# Altium project Modulo Banco MK1.PrjPcb (part 2 of 2)

## Sheet ADCs.SchDoc
size A4; SheetNumber: 5; SheetTotal: 6; SPICEModelCacheMZQGRJLK: <root> / <DocumentId>MZQGRJLK</DocumentId> / <CacheFrame Number="0"> / <Model Name="0603_885012206052_1uf" Kind="CKT"> / <Text>******* / .subckt 0603_885012206052_1uF 1 2 / Rser 1 3 0.00742821402486 / Lser 2 4 2.51142993E-10 / C1 3 4 0.000001 / Rpar 3 4 100000000 / .ends 0603_885012206052_1uF</Text> / </Model> / <Model Name="0603_885012206071_100nf" Kind="CKT"> / <Text>******* / .subckt 0603_885012206071_100nF 1 2 / Rser 1 3 0.025 / Lser 2 4 0.0000000008 / C1 3 4 0.0000001 / Rpar 3 4 5000000000 / .ends 0603_885012206071_100nF</Text> / </Model> / </CacheFrame> / </root>
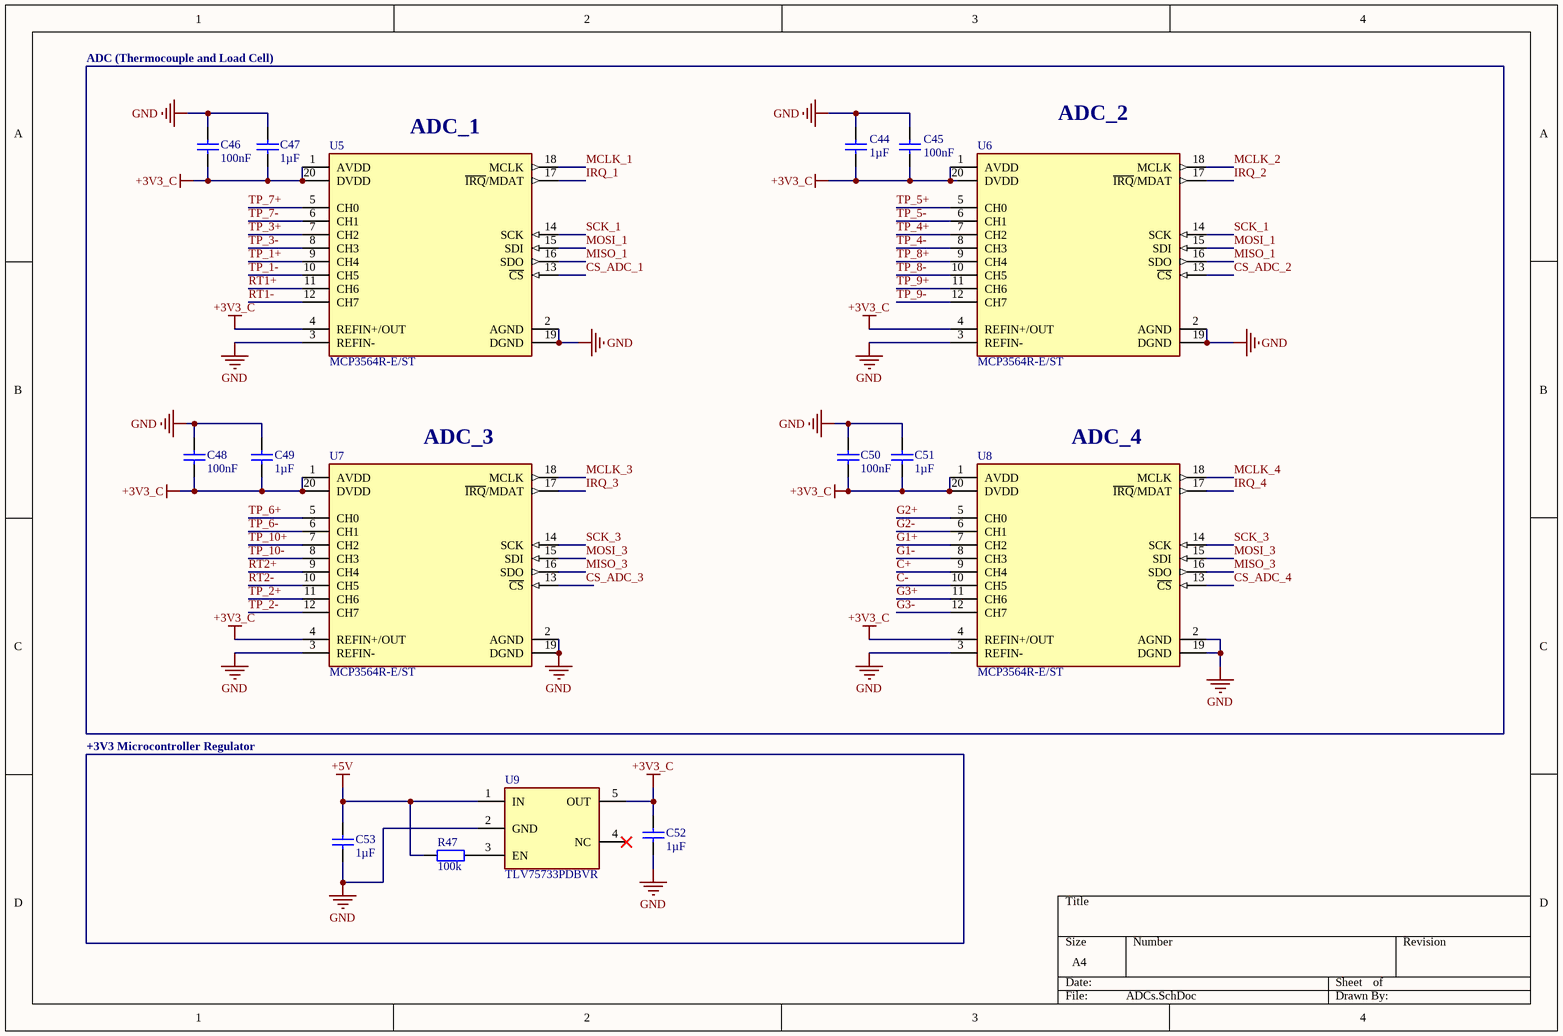
[diagram p4: ADCs.SchDoc]

### Parts
C44  value 1µF  [WCAP-CSGP_0603_L1.6W0.8H0.8_Reflow]  (hidden comment: 885012206052)
C45  value 100nF  [WCAP-CSGP_0603_L1.6W0.8H0.8_Reflow]  (hidden comment: 885012206071)
C46  value 100nF  [WCAP-CSGP_0603_L1.6W0.8H0.8_Reflow]  (hidden comment: 885012206071)
C47  value 1µF  [WCAP-CSGP_0603_L1.6W0.8H0.8_Reflow]  (hidden comment: 885012206052)
C48  value 100nF  [WCAP-CSGP_0603_L1.6W0.8H0.8_Reflow]  (hidden comment: 885012206071)
C49  value 1µF  [WCAP-CSGP_0603_L1.6W0.8H0.8_Reflow]  (hidden comment: 885012206052)
C50  value 100nF  [WCAP-CSGP_0603_L1.6W0.8H0.8_Reflow]  (hidden comment: 885012206071)
C51  value 1µF  [WCAP-CSGP_0603_L1.6W0.8H0.8_Reflow]  (hidden comment: 885012206052)
C52  value 1µF  [WCAP-CSGP_0603_L1.6W0.8H0.8_Reflow]  (hidden comment: 885012206052)
C53  value 1µF  [WCAP-CSGP_0603_L1.6W0.8H0.8_Reflow]  (hidden comment: 885012206052)
R47  value 100k  [WRIS-RSKS_0603_Reflow]  (hidden comment: 560112116004)
U5  MCP3564R-E/ST  [FP-C04-088-MFG]
U6  MCP3564R-E/ST  [FP-C04-088-MFG]
U7  MCP3564R-E/ST  [FP-C04-088-MFG]
U8  MCP3564R-E/ST  [FP-C04-088-MFG]
U9  TLV75733PDBVR  [SOT95P280X145-5N]

### Blocks framed on the sheet
+3V3 Microcontroller Regulator: C52 C53 R47 U9

### Nets
+3V3_C: C44.2 C45.1 C46.2 C47.1 C48.2 C49.1 C50.2 C51.1 C52.2 U5.1(AVDD) U5.4(REFIN+/OUT) U5.20(DVDD) U6.1(AVDD) U6.4(REFIN+/OUT) U6.20(DVDD) U7.1(AVDD) U7.4(REFIN+/OUT) U7.20(DVDD) U8.1(AVDD) U8.4(REFIN+/OUT) U8.20(DVDD) U9.5(OUT)
+5V: C53.2 R47.1 U9.1(IN)  [project net 5V_Current-]
GND: C44.1 C45.2 C46.1 C47.2 C48.1 C49.2 C50.1 C51.2 C52.1 C53.1 U5.2(AGND) U5.3(REFIN-) U5.19(DGND) U6.2(AGND) U6.3(REFIN-) U6.19(DGND) U7.2(AGND) U7.3(REFIN-) U7.19(DGND) U8.2(AGND) U8.3(REFIN-) U8.19(DGND) U9.2(GND)
C+: U8.9(CH4)
C-: U8.10(CH5)
CS_ADC_1: U5.13(~{CS})
CS_ADC_2: U6.13(~{CS})
CS_ADC_3: U7.13(~{CS})
CS_ADC_4: U8.13(~{CS})
G1+: U8.7(CH2)
G1-: U8.8(CH3)
G2+: U8.5(CH0)
G2-: U8.6(CH1)
G3+: U8.11(CH6)
G3-: U8.12(CH7)
IRQ_1: U5.17(~{IRQ}/MDAT)
IRQ_2: U6.17(~{IRQ}/MDAT)
IRQ_3: U7.17(~{IRQ}/MDAT)
IRQ_4: U8.17(~{IRQ}/MDAT)
MCLK_1: U5.18(MCLK)
MCLK_2: U6.18(MCLK)
MCLK_3: U7.18(MCLK)
MCLK_4: U8.18(MCLK)
MISO_1: U5.16(SDO) U6.16(SDO)
MISO_3: U7.16(SDO) U8.16(SDO)
MOSI_1: U5.15(SDI) U6.15(SDI)
MOSI_3: U7.15(SDI) U8.15(SDI)
RT1+: U5.11(CH6)
RT1-: U5.12(CH7)
RT2+: U7.9(CH4)
RT2-: U7.10(CH5)
SCK_1: U5.14(SCK) U6.14(SCK)
SCK_3: U7.14(SCK) U8.14(SCK)
TP_1+: U5.9(CH4)
TP_1-: U5.10(CH5)
TP_2+: U7.11(CH6)
TP_2-: U7.12(CH7)
TP_3+: U5.7(CH2)
TP_3-: U5.8(CH3)
TP_4+: U6.7(CH2)
TP_4-: U6.8(CH3)
TP_5+: U6.5(CH0)
TP_5-: U6.6(CH1)
TP_6+: U7.5(CH0)
TP_6-: U7.6(CH1)
TP_7+: U5.5(CH0)
TP_7-: U5.6(CH1)
TP_8+: U6.9(CH4)
TP_8-: U6.10(CH5)
TP_9+: U6.11(CH6)
TP_9-: U6.12(CH7)
TP_10+: U7.7(CH2)
TP_10-: U7.8(CH3)
NetR47_2: R47.2 U9.3(EN)

Not connected (* = marked no-connect by the designer): U9 4(NC)*

### Notes on the sheet
- ADC (Thermocouple and Load Cell)
- (near U5) ADC_1
- (near U6) ADC_2
- (near U7) ADC_3
- (near U8) ADC_4

### Library data of the parts
C44 C47 C49 C51-C53 = CMP-001-00642-1: WCAP-CSGP Multilayer Ceramic Chip Capacitor, General Purpose, size 0603, X7R, 1uF, 16VDC; Manufacturer: Wurth Elektronik; Capacitance Tolerance: +/-10%; Insulation Resistance: 0.1GOhm; Rated Voltage (DC): 16V; Dissipation Factor: 10%; Technical Reference: X7R0603105K016DFCT10000; Component Type: Standard; Width: 0.8mm; Ceramic Type: X7R; ComponentLink1Description: Website Link; ComponentLink1URL: https://www.we-online.com/redexpert/article/885012206052?ad; Height: 0.8mm; Manufacturer Part Number: 885012206052; Match Code: WCAP-CSGP; Source: WCAP-CSGP.SchLib; Case/Package: 0603; Operating Temperature Min: -55°C; ComponentLink2Description: Datasheet Link; Design Item ID: 885012206052; ComponentLink2URL: https://www.we-online.com/redexpert/spec/885012206052?ad; Category: Multilayer Ceramic Chip Capacitors; Packaging: Tape and Reel; Pins: 2; Length: 1.6mm; Operating Temperature Max: 125°C; Mount: Surface Mount
C45 C46 C48 C50 = CMP-001-00661-1: WCAP-CSGP Multilayer Ceramic Chip Capacitor, General Purpose, size 0603, X7R, 100nF, 25VDC; Manufacturer: Wurth Elektronik; Dissipation Factor: 3.5%; Capacitance Tolerance: +/-10%; Insulation Resistance: 5GOhm; Technical Reference: X7R0603104K025DFCT10000; Rated Voltage (DC): 25V; Packaging: Tape and Reel; Height: 0.8mm; Mount: Surface Mount; Source: WCAP-CSGP.SchLib; Component Type: Standard; Category: Multilayer Ceramic Chip Capacitors; Operating Temperature Min: -55°C; Case/Package: 0603; ComponentLink2Description: Datasheet Link; Width: 0.8mm; ComponentLink1URL: https://www.we-online.com/redexpert/article/885012206071?ad; Length: 1.6mm; Operating Temperature Max: 125°C; Match Code: WCAP-CSGP; ComponentLink2URL: https://www.we-online.com/redexpert/spec/885012206071?ad; Design Item ID: 885012206071; ComponentLink1Description: Website Link; Manufacturer Part Number: 885012206071; Pins: 2; Ceramic Type: X7R
R47 = CMP-009-00327-1: WRIS-RSKS Thick Film Resistor, size 0603, 100000Ohm, 100mW; Manufacturer: Wurth Elektronik; Temperature Coefficient of Resistance Min: -100ppm/°C; Resistance Tolerance: +/-1%; Limiting Element Voltage: 75V; Temperature Coefficient of Resistance Max: 100ppm/°C; Height: 0.45mm; ComponentLink1URL: https://www.we-online.com/redexpert/article/560112116004?ad; Packaging: Tape and Reel; Match Code: WRIS-RSKS; Operating Temperature Max: 155°C; ComponentLink2Description: Datasheet Link; ComponentLink1Description: Website Link; Category: Thick Film Resistors; Operating Temperature Min: -55°C; Length: 1.6mm; Source: WRIS-RSKS.SchLib; Rated Power: 100mW; Mount: Surface Mount; Manufacturer Part Number: 560112116004; ComponentLink2URL: https://www.we-online.com/redexpert/spec/560112116004?ad; Component Type: Standard; Width: 0.8mm; Case/Package: 0603; Pins: 2; Design Item ID: 560112116004
U5-U8 = CMP-015-00000-1: ADC, Delta-Sigma, 24-Bit, 1 Func, 8 Channel, Serial Access, PDSO20; RoHS Compliant: Yes
U9 = CMP-087-000000-3: LDO Voltage Regulators 1A Low-IQ Small-Size Low-Dropout (LDO) Regulator 5-SOT-23 -40 to 125; Manufacturer: Texas Instruments; Manufacturer Part Number: TLV75733PDBVR

## Sheet Sensing current.SchDoc
size A4; SheetNumber: 6; SheetTotal: 6; SPICEModelCacheWDWOYDAG: <root> / <DocumentId>WDWOYDAG</DocumentId> / <CacheFrame Number="0"> / <Model Name="0603_885012206062_3.3nf" Kind="CKT"> / <Text>******* / .subckt 0603_885012206062_3.3nF 1 2 / Rser 1 3 0.09865 / Lser 2 4 0.0000000003316 / C1 3 4 0.0000000033 / Rpar 3 4 10000000000 / .ends 0603_885012206062_3.3nF</Text> / </Model> / </CacheFrame> / </root>
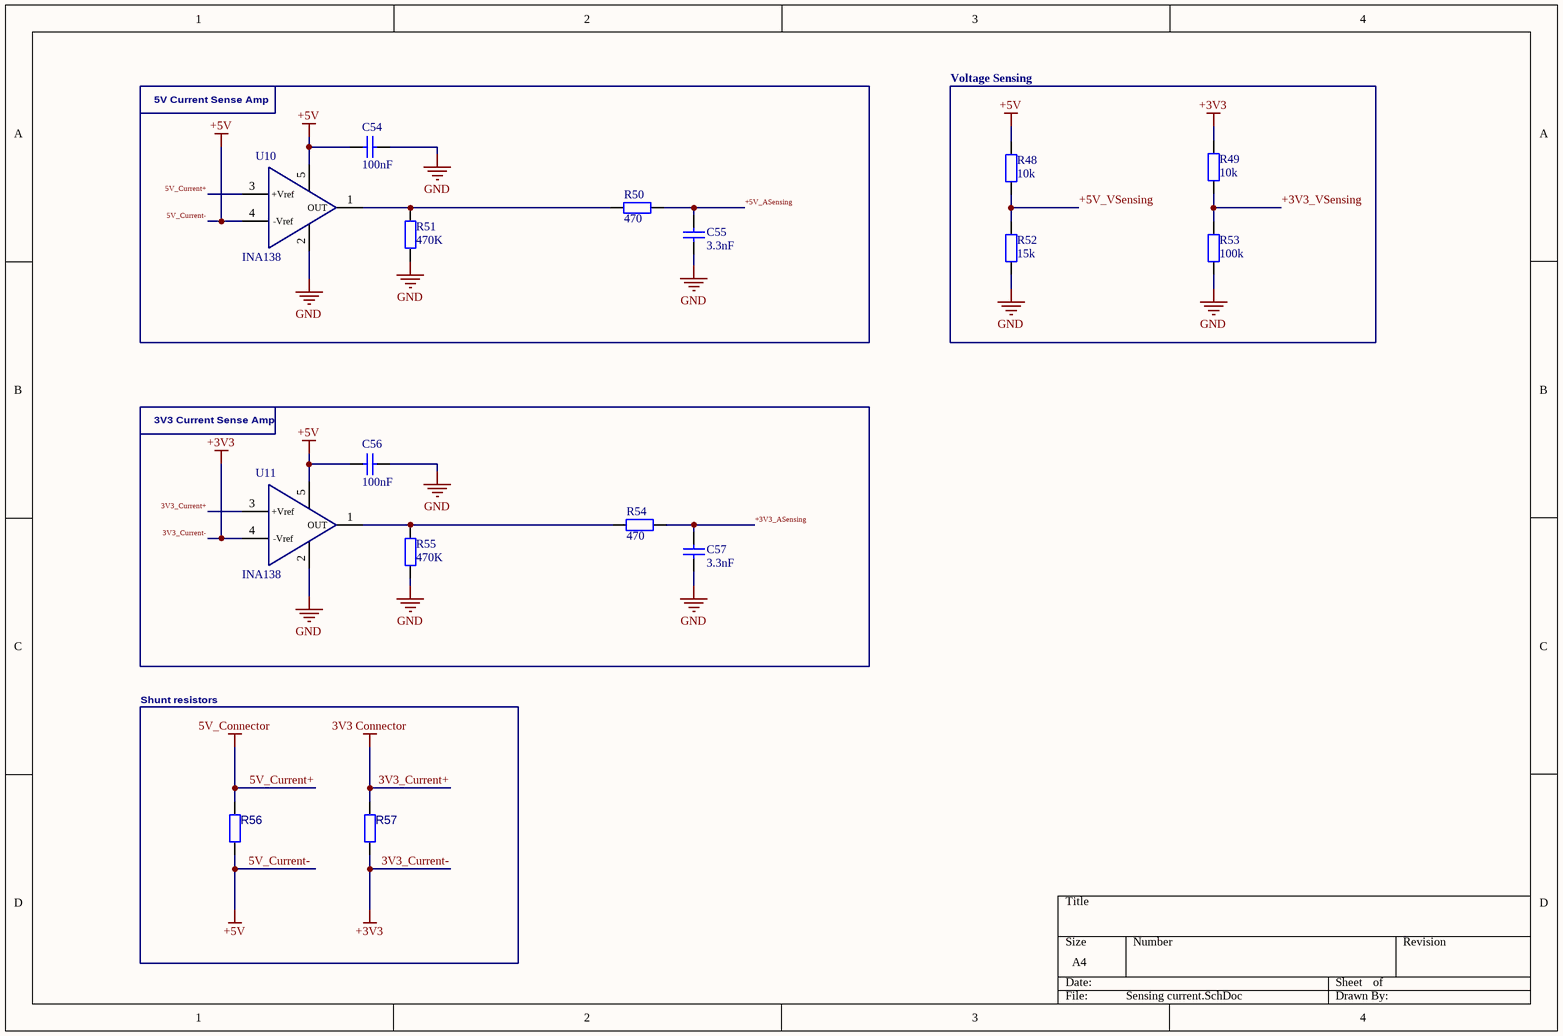
[diagram p5: Sensing current.SchDoc]

### Parts
C54  value 100nF  [WCAP-CSGP_0603_L1.6W0.8H0.8_Reflow]  (hidden comment: 885012206071)
C55  value 3.3nF  [WCAP-CSGP_0603_L1.6W0.8H0.8_Reflow]  (hidden comment: 885012206062)
C56  value 100nF  [WCAP-CSGP_0603_L1.6W0.8H0.8_Reflow]  (hidden comment: 885012206071)
C57  value 3.3nF  [WCAP-CSGP_0603_L1.6W0.8H0.8_Reflow]  (hidden comment: 885012206062)
R48  value 10k  [WRIS-RSKS_0603_Reflow]  (hidden comment: 560112116005)
R49  value 10k  [WRIS-RSKS_0603_Reflow]  (hidden comment: 560112116005)
R50  value 470  [WRIS-RSKS_0603_Reflow]  (hidden comment: 560112116067)
R51  value 470K  [WRIS-RSKS_0603_Reflow]  (hidden comment: 560112116019)
R52  value 15k  [WRIS-RSKS_0603_Reflow]  (hidden comment: 560112116035)
R53  value 100k  [WRIS-RSKS_0603_Reflow]  (hidden comment: 560112116004)
R54  value 470  [WRIS-RSKS_0603_Reflow]  (hidden comment: 560112116067)
R55  value 470K  [WRIS-RSKS_0603_Reflow]  (hidden comment: 560112116019)
R56  580070763010  [580070763010-Footprint-1]  (value not drawn)
R57  580070763010  [580070763010-Footprint-1]  (value not drawn)
U10  INA138  [INA138-Footprint-1]
U11  INA138  [INA138-Footprint-1]

### Blocks framed on the sheet
5V Current Sense Amp: C54 C55 R50 R51 U10
Voltage Sensing: R48 R49 R52 R53
3V3 Current Sense Amp: C56 C57 R54 R55 U11
Shunt resistors: R56 R57

### Nets
3V3_Current+: R57.2 U11.3(+Vref)  [also labelled 3V3 Connector]
3V3_Current-: R49.2 R57.1 U11.4(-Vref)  [also labelled +3V3]
5V_Current+: R56.2 U10.3(+Vref)  [also labelled 5V_Connector]
5V_Current-: C54.2 C56.2 R48.2 R56.1 U10.4(-Vref) U10.5(V+) U11.5(V+)  [also labelled +5V]
GND: C54.1 C55.1 C56.1 C57.1 R51.1 R52.1 R53.1 R55.1 U10.2(GND) U11.2(GND)
+3V3_ASensing: C57.2 R54.1
+3V3_VSensing: R49.1 R53.2
+5V_ASensing: C55.2 R50.1
+5V_VSensing: R48.1 R52.2
NetR50_2: R50.2 R51.2 U10.1(OUT)
NetR54_2: R54.2 R55.2 U11.1(OUT)

### Library data of the parts
C54 C56 = CMP-001-00661-1: as C45 on sheet ADCs; Packaging: Tape and Reel; Height: 0.8mm; Mount: Surface Mount; Source: WCAP-CSGP.SchLib; Component Type: Standard; Category: Multilayer Ceramic Chip Capacitors; Operating Temperature Min: -55°C; Case/Package: 0603; ComponentLink2Description: Datasheet Link; Width: 0.8mm; ComponentLink1URL: https://www.we-online.com/redexpert/article/885012206071?ad; Length: 1.6mm; Operating Temperature Max: 125°C; Match Code: WCAP-CSGP; ComponentLink2URL: https://www.we-online.com/redexpert/spec/885012206071?ad; Design Item ID: 885012206071; ComponentLink1Description: Website Link; Manufacturer Part Number: 885012206071; Pins: 2; Ceramic Type: X7R
C55 C57 = CMP-001-00652-1: WCAP-CSGP Multilayer Ceramic Chip Capacitor, General Purpose, size 0603, X7R, 3.3nF, 25VDC; Manufacturer: Wurth Elektronik; Capacitance Tolerance: +/-10%; Technical Reference: X7R0603332K025DFCT10000; Dissipation Factor: 3.5%; Rated Voltage (DC): 25V; Insulation Resistance: 10GOhm; ComponentLink2Description: Datasheet Link; Source: WCAP-CSGP.SchLib; Pins: 2; Operating Temperature Min: -55°C; Length: 1.6mm; ComponentLink2URL: https://www.we-online.com/redexpert/spec/885012206062?ad; Ceramic Type: X7R; Manufacturer Part Number: 885012206062; ComponentLink1URL: https://www.we-online.com/redexpert/article/885012206062?ad; ComponentLink1Description: Website Link; Mount: Surface Mount; Case/Package: 0603; Packaging: Tape and Reel; Component Type: Standard; Height: 0.8mm; Operating Temperature Max: 125°C; Width: 0.8mm; Match Code: WCAP-CSGP; Category: Multilayer Ceramic Chip Capacitors; Design Item ID: 885012206062
R48 R49 = CMP-009-00328-1: WRIS-RSKS Thick Film Resistor, size 0603, 10000Ohm, 100mW; Manufacturer: Wurth Elektronik; Limiting Element Voltage: 75V; Temperature Coefficient of Resistance Max: 100ppm/°C; Resistance Tolerance: +/-1%; Temperature Coefficient of Resistance Min: -100ppm/°C; ComponentLink1Description: Website Link; Case/Package: 0603; Pins: 2; Match Code: WRIS-RSKS; Operating Temperature Max: 155°C; Width: 0.8mm; Design Item ID: 560112116005; Length: 1.6mm; ComponentLink2Description: Datasheet Link; ComponentLink2URL: https://www.we-online.com/redexpert/spec/560112116005?ad; Packaging: Tape and Reel; Source: WRIS-RSKS.SchLib; Height: 0.45mm; Manufacturer Part Number: 560112116005; Component Type: Standard; Mount: Surface Mount; Operating Temperature Min: -55°C; Rated Power: 100mW; ComponentLink1URL: https://www.we-online.com/redexpert/article/560112116005?ad; Category: Thick Film Resistors
R50 R54 = CMP-009-00390-1: WRIS-RSKS Thick Film Resistor, size 0603, 470Ohm, 100mW; Manufacturer: Wurth Elektronik; Limiting Element Voltage: 75V; Temperature Coefficient of Resistance Max: 100ppm/°C; Resistance Tolerance: +/-1%; Temperature Coefficient of Resistance Min: -100ppm/°C; Rated Power: 100mW; Height: 0.45mm; ComponentLink2Description: Datasheet Link; Component Type: Standard; ComponentLink1URL: https://www.we-online.com/redexpert/article/560112116067?ad; ComponentLink1Description: Website Link; Operating Temperature Min: -55°C; Match Code: WRIS-RSKS; Mount: Surface Mount; Case/Package: 0603; Source: WRIS-RSKS.SchLib; Length: 1.6mm; Category: Thick Film Resistors; Operating Temperature Max: 155°C; Pins: 2; Packaging: Tape and Reel; Manufacturer Part Number: 560112116067; ComponentLink2URL: https://www.we-online.com/redexpert/spec/560112116067?ad; Width: 0.8mm; Design Item ID: 560112116067
R51 R55 = CMP-009-00342-1: WRIS-RSKS Thick Film Resistor, size 0603, 470000Ohm, 100mW; Manufacturer: Wurth Elektronik; Temperature Coefficient of Resistance Min: -100ppm/°C; Resistance Tolerance: +/-1%; Limiting Element Voltage: 75V; Temperature Coefficient of Resistance Max: 100ppm/°C; Component Type: Standard; ComponentLink2URL: https://www.we-online.com/redexpert/spec/560112116019?ad; ComponentLink1Description: Website Link; Height: 0.45mm; Source: WRIS-RSKS.SchLib; ComponentLink1URL: https://www.we-online.com/redexpert/article/560112116019?ad; Category: Thick Film Resistors; Mount: Surface Mount; Operating Temperature Min: -55°C; Rated Power: 100mW; Pins: 2; Packaging: Tape and Reel; Match Code: WRIS-RSKS; Width: 0.8mm; ComponentLink2Description: Datasheet Link; Design Item ID: 560112116019; Operating Temperature Max: 155°C; Manufacturer Part Number: 560112116019; Length: 1.6mm; Case/Package: 0603
R52 = CMP-009-00358-1: WRIS-RSKS Thick Film Resistor, size 0603, 15000Ohm, 100mW; Manufacturer: Wurth Elektronik; Limiting Element Voltage: 75V; Temperature Coefficient of Resistance Min: -100ppm/°C; Resistance Tolerance: +/-1%; Temperature Coefficient of Resistance Max: 100ppm/°C; Match Code: WRIS-RSKS; Design Item ID: 560112116035; Case/Package: 0603; ComponentLink2URL: https://www.we-online.com/redexpert/spec/560112116035?ad; Category: Thick Film Resistors; Source: WRIS-RSKS.SchLib; ComponentLink2Description: Datasheet Link; Pins: 2; ComponentLink1Description: Website Link; Operating Temperature Max: 155°C; Height: 0.45mm; Length: 1.6mm; Component Type: Standard; Packaging: Tape and Reel; Manufacturer Part Number: 560112116035; Width: 0.8mm; Rated Power: 100mW; Mount: Surface Mount; ComponentLink1URL: https://www.we-online.com/redexpert/article/560112116035?ad; Operating Temperature Min: -55°C
R53 = CMP-009-00327-1: as R47 on sheet ADCs; Height: 0.45mm; ComponentLink1URL: https://www.we-online.com/redexpert/article/560112116004?ad; Packaging: Tape and Reel; Match Code: WRIS-RSKS; Operating Temperature Max: 155°C; ComponentLink2Description: Datasheet Link; ComponentLink1Description: Website Link; Category: Thick Film Resistors; Operating Temperature Min: -55°C; Length: 1.6mm; Source: WRIS-RSKS.SchLib; Rated Power: 100mW; Mount: Surface Mount; Manufacturer Part Number: 560112116004; ComponentLink2URL: https://www.we-online.com/redexpert/spec/560112116004?ad; Component Type: Standard; Width: 0.8mm; Case/Package: 0603; Pins: 2; Design Item ID: 560112116004
R56 R57 = CMP-009-00124-2: Res, 0R01, 1%, 2W, Metal Foil, 0612 Rohs Compliant: Yes
U10 U11 = CMP-014-00004-3: Shunt Current Measure Amplifier; Manufacturer: Texas Instruments; Manufacturer Part Number: INA138NA/3K
  U10: ClassName: 5V OPAMP
  U11: ClassName: 3V3 OPAMP

## Nets that join several sheets
3V3_Current+: Connectors_ADC (5 pins), Sensing current (R57.2 U11.3)
3V3_Current-: MCU (R3.2 R4.2 R7.1), Sensors (14 pins), Sensing current (R49.2 R57.1 U11.4)
5V_Current+: Connectors_ADC (5 pins), Sensing current (R56.2 U10.3)
5V_Current-: MCU (5 pins), ADCs (C53.2 R47.1 U9.1), Sensing current (7 pins)
+3V3_C: MCU (14 pins), Connectors_ADC (7 pins), Connectors_General (P25.4), Sensors (6 pins), ADCs (22 pins)
GND: MCU (29 pins), Connectors_ADC (38 pins), Connectors_General (D7.2 D8.2 D9.2 P25.2), Sensors (18 pins), ADCs (23 pins), Sensing current (10 pins)
+3V3_ASensing: MCU (U1.10), Sensing current (C57.2 R54.1)
+3V3_VSensing: MCU (U1.9), Sensing current (R49.1 R53.2)
+5V_ASensing: MCU (U1.8), Sensing current (C55.2 R50.1)
+5V_VSensing: MCU (U1.29), Sensing current (R48.1 R52.2)
C+: Connectors_ADC (C35.1 R29.1), ADCs (U8.9)
C-: Connectors_ADC (C36.1 R32.1), ADCs (U8.10)
CAN1_N: MCU (Q1.6 R2.1), Connectors_General (D7.4)
CAN1_P: MCU (Q1.7 R2.2), Connectors_General (D7.6)
CAN2_N: MCU (Q2.6 R5.1), Connectors_General (D8.4)
CAN2_P: MCU (Q2.7 R5.2), Connectors_General (D8.6)
CS_ADC_1: MCU (U1.32), ADCs (U5.13)
CS_ADC_2: MCU (U1.16), ADCs (U6.13)
CS_ADC_3: MCU (U1.3), ADCs (U7.13)
CS_ADC_4: MCU (U1.46), ADCs (U8.13)
G1+: Connectors_ADC (P13.2), ADCs (U8.7)
G1-: Connectors_ADC (R30.1 R33.2), ADCs (U8.8)
G2+: Connectors_ADC (P19.2), ADCs (U8.5)
G2-: Connectors_ADC (R35.1 R39.2), ADCs (U8.6)
G3+: Connectors_ADC (P20.2), ADCs (U8.11)
G3-: Connectors_ADC (R37.1 R40.2), ADCs (U8.12)
INT0_ITDS: MCU (U1.28), Sensors (U3.12)
IRQ_1: MCU (U1.22), ADCs (U5.17)
IRQ_2: MCU (U1.17), ADCs (U6.17)
IRQ_3: MCU (U1.4), ADCs (U7.17)
IRQ_4: MCU (U1.44), ADCs (U8.17)
MCLK_1: MCU (U1.18), ADCs (U5.18)
MCLK_2: MCU (U1.12), ADCs (U6.18)
MCLK_3: MCU (U1.2), ADCs (U7.18)
MCLK_4: MCU (U1.43), ADCs (U8.18)
MISO_1: MCU (U1.14), ADCs (U5.16 U6.16)
MISO_3: MCU (U1.41), ADCs (U7.16 U8.16)
MOSI_1: MCU (U1.15), ADCs (U5.15 U6.15)
MOSI_3: MCU (U1.42), ADCs (U7.15 U8.15)
RT1+: Sensors (R42.1 RT1.2), ADCs (U5.11)
RT1-: Sensors (R41.1 R43.2), ADCs (U5.12)
RT2+: Sensors (R45.1 RT2.2), ADCs (U7.9)
RT2-: Sensors (R44.1 R46.2), ADCs (U7.10)
SCK_1: MCU (U1.13), ADCs (U5.14 U6.14)
SCK_3: MCU (U1.40), ADCs (U7.14 U8.14)
SCL: MCU (R3.1 U1.31), Sensors (U2.2 U3.1 U4.2)
SDA: MCU (R4.1 U1.30), Sensors (U2.1 U3.4 U4.4)
SWCLK: MCU (U1.38), Connectors_General (D9.1)
SWDIO: MCU (U1.37), Connectors_General (D9.3)
TP_1+: Connectors_ADC (C15.1 R9.1), ADCs (U5.9)
TP_1-: Connectors_ADC (C20.2 R14.1), ADCs (U5.10)
TP_2+: Connectors_ADC (C16.1 R10.1), ADCs (U7.11)
TP_2-: Connectors_ADC (C21.2 R15.1), ADCs (U7.12)
TP_3+: Connectors_ADC (C17.1 R11.1), ADCs (U5.7)
TP_3-: Connectors_ADC (C22.2 R16.1), ADCs (U5.8)
TP_4+: Connectors_ADC (C18.1 R12.1), ADCs (U6.7)
TP_4-: Connectors_ADC (C23.2 R17.1), ADCs (U6.8)
TP_5+: Connectors_ADC (C19.1 R13.1), ADCs (U6.5)
TP_5-: Connectors_ADC (C24.2 R18.1), ADCs (U6.6)
TP_6+: Connectors_ADC (C25.1 R19.1), ADCs (U7.5)
TP_6-: Connectors_ADC (C30.2 R24.1), ADCs (U7.6)
TP_7+: Connectors_ADC (C26.1 R20.1), ADCs (U5.5)
TP_7-: Connectors_ADC (C31.2 R25.1), ADCs (U5.6)
TP_8+: Connectors_ADC (C27.1 R21.1), ADCs (U6.9)
TP_8-: Connectors_ADC (C32.2 R26.1), ADCs (U6.10)
TP_9+: Connectors_ADC (C28.1 R22.1), ADCs (U6.11)
TP_9-: Connectors_ADC (C33.2 R27.1), ADCs (U6.12)
TP_10+: Connectors_ADC (C29.1 R23.1), ADCs (U7.7)
TP_10-: Connectors_ADC (C34.2 R28.1), ADCs (U7.8)
TRANSDUCER: MCU (U1.25), Connectors_ADC (P16.1 R34.2)